# EasyEDA schematic SCH_TRAILDEV.json
TITLE: Sheet_1; REV: 1.0; Date: 2024-04-24; Sheet: 1/1; Drawn By: rivques; Company: Your Company
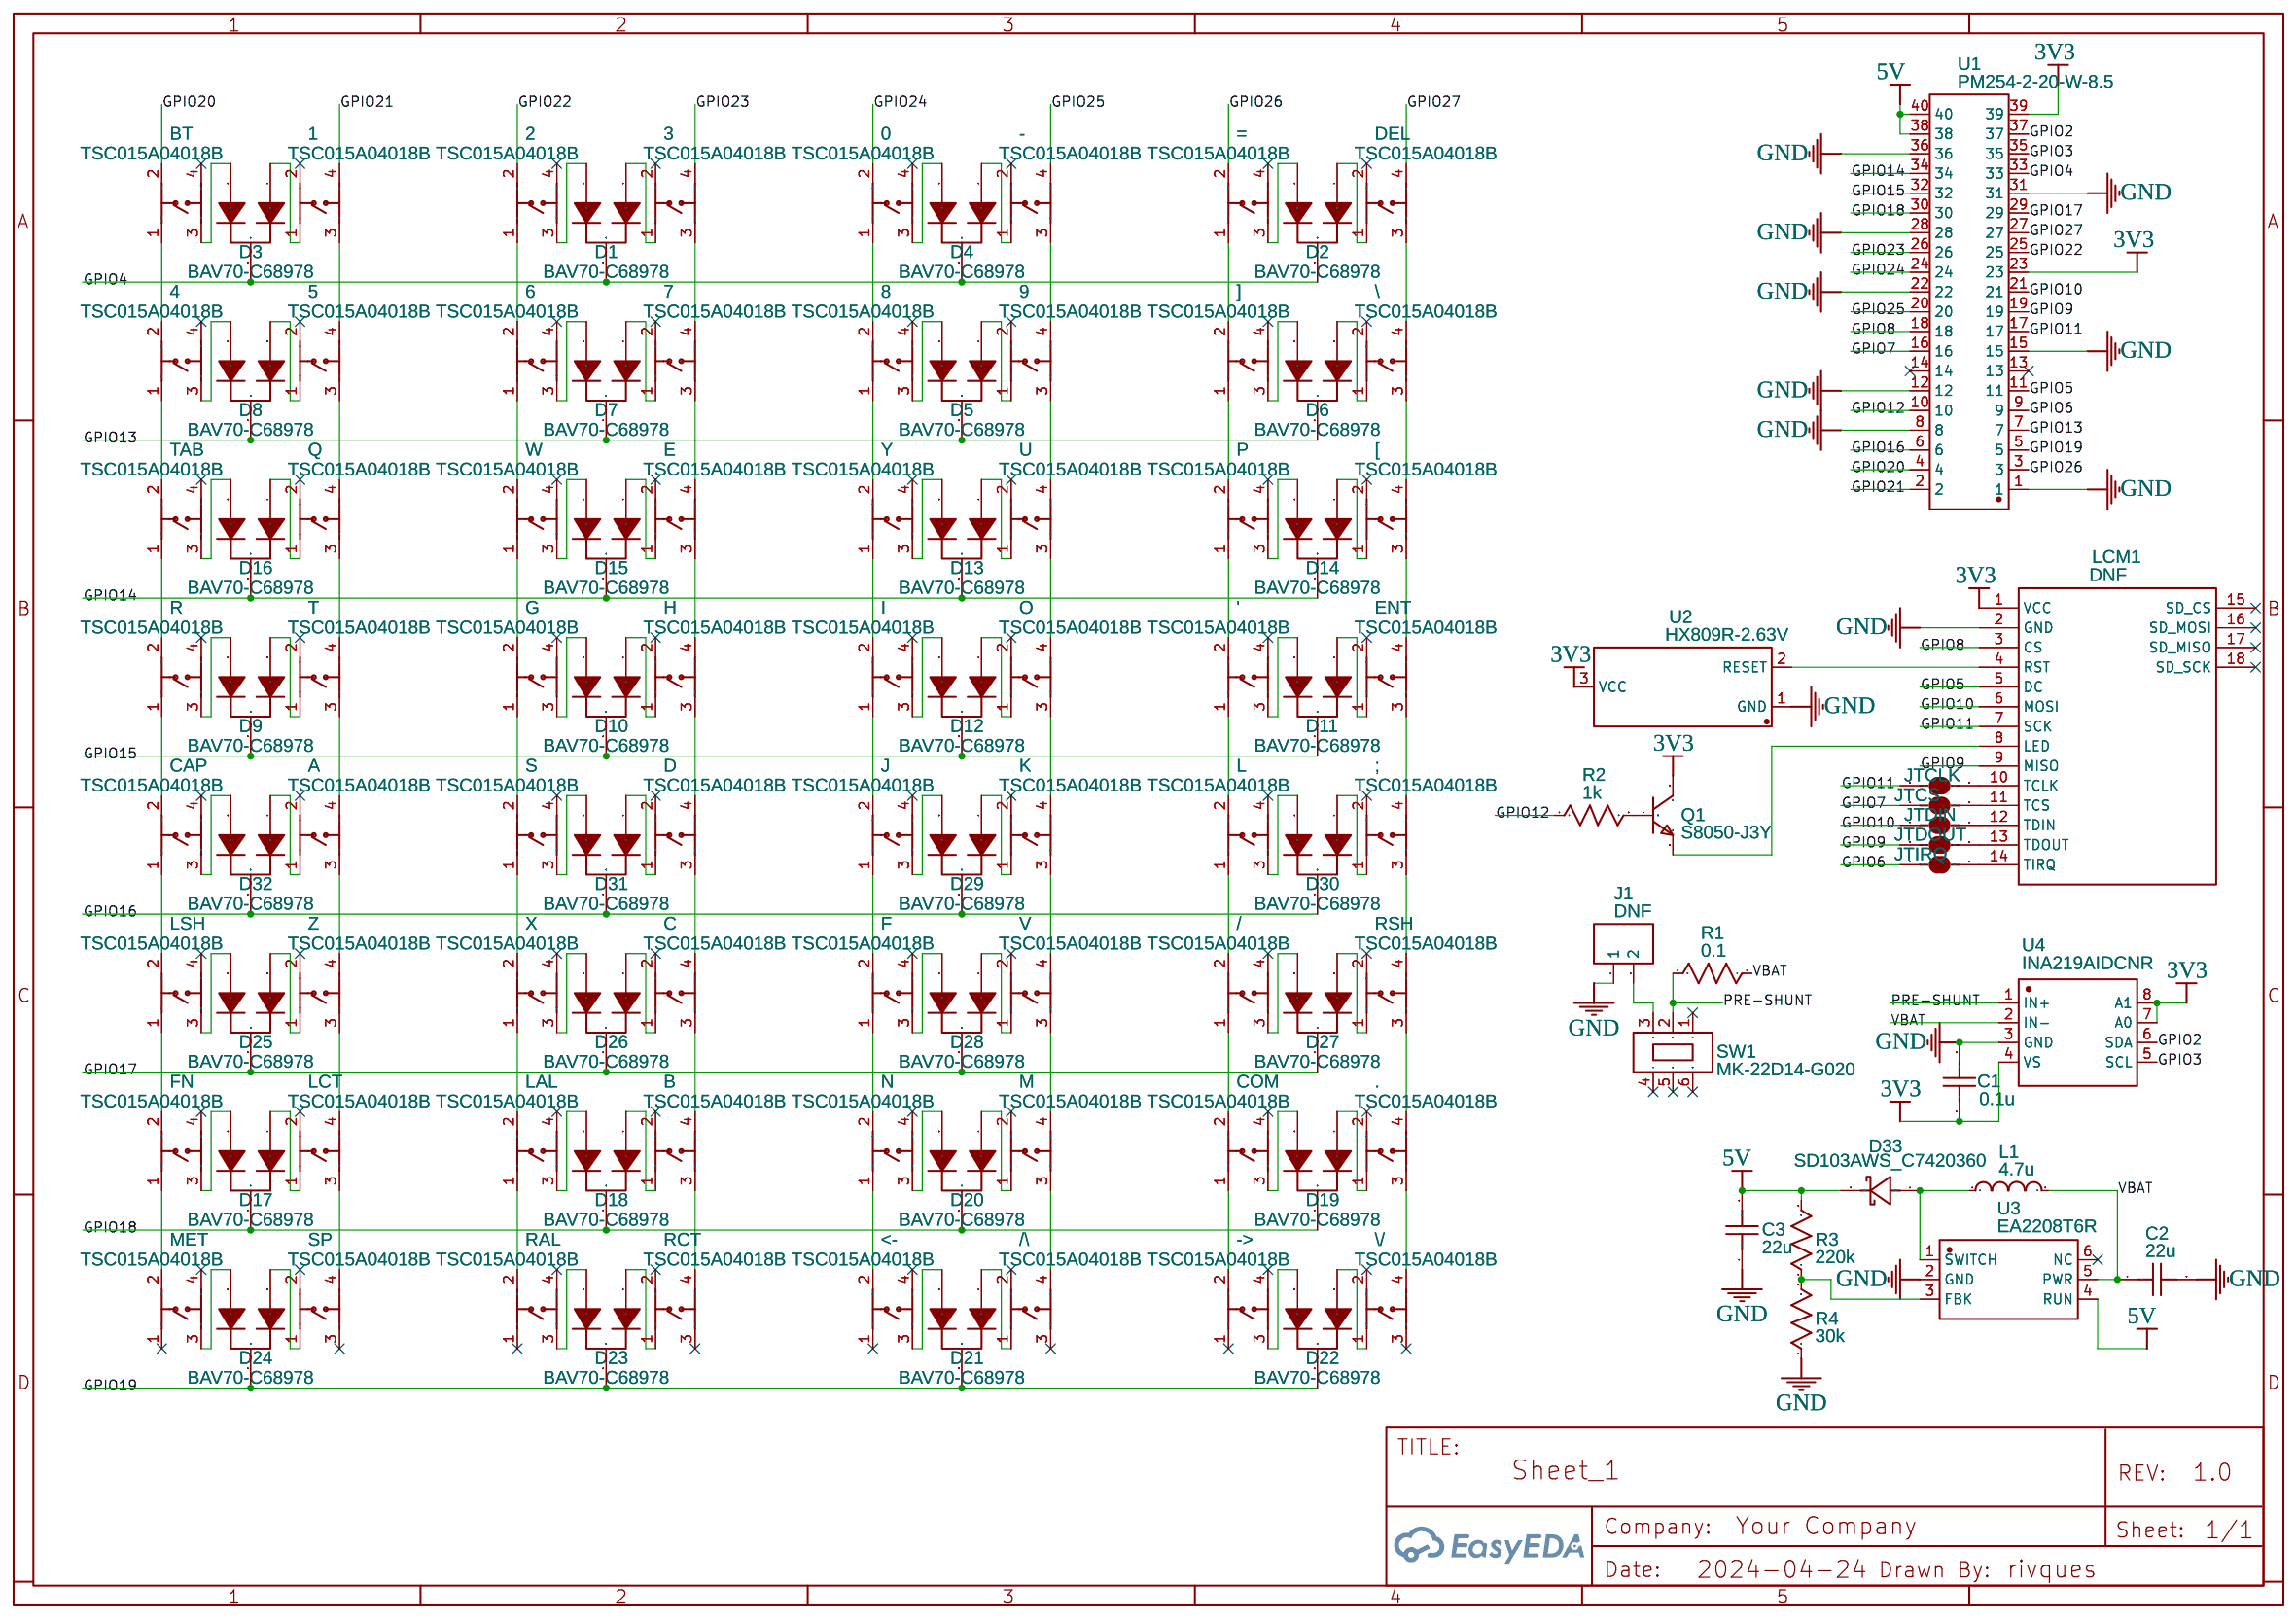
[diagram p0: schematic sheet]

## Parts
0  TSC015A04018B  [SW-SMD_4P-L4.5-W4.5-P3.00-LS6.8]
1  TSC015A04018B  [SW-SMD_4P-L4.5-W4.5-P3.00-LS6.8]
2  TSC015A04018B  [SW-SMD_4P-L4.5-W4.5-P3.00-LS6.8]
3  TSC015A04018B  [SW-SMD_4P-L4.5-W4.5-P3.00-LS6.8]
4  TSC015A04018B  [SW-SMD_4P-L4.5-W4.5-P3.00-LS6.8]
5  TSC015A04018B  [SW-SMD_4P-L4.5-W4.5-P3.00-LS6.8]
6  TSC015A04018B  [SW-SMD_4P-L4.5-W4.5-P3.00-LS6.8]
7  TSC015A04018B  [SW-SMD_4P-L4.5-W4.5-P3.00-LS6.8]
8  TSC015A04018B  [SW-SMD_4P-L4.5-W4.5-P3.00-LS6.8]
9  TSC015A04018B  [SW-SMD_4P-L4.5-W4.5-P3.00-LS6.8]
'  TSC015A04018B  [SW-SMD_4P-L4.5-W4.5-P3.00-LS6.8]
-  TSC015A04018B  [SW-SMD_4P-L4.5-W4.5-P3.00-LS6.8]
->  TSC015A04018B  [SW-SMD_4P-L4.5-W4.5-P3.00-LS6.8]
.  TSC015A04018B  [SW-SMD_4P-L4.5-W4.5-P3.00-LS6.8]
/  TSC015A04018B  [SW-SMD_4P-L4.5-W4.5-P3.00-LS6.8]
/\  TSC015A04018B  [SW-SMD_4P-L4.5-W4.5-P3.00-LS6.8]
;  TSC015A04018B  [SW-SMD_4P-L4.5-W4.5-P3.00-LS6.8]
<-  TSC015A04018B  [SW-SMD_4P-L4.5-W4.5-P3.00-LS6.8]
=  TSC015A04018B  [SW-SMD_4P-L4.5-W4.5-P3.00-LS6.8]
[  TSC015A04018B  [SW-SMD_4P-L4.5-W4.5-P3.00-LS6.8]
\  TSC015A04018B  [SW-SMD_4P-L4.5-W4.5-P3.00-LS6.8]
\/  TSC015A04018B  [SW-SMD_4P-L4.5-W4.5-P3.00-LS6.8]
]  TSC015A04018B  [SW-SMD_4P-L4.5-W4.5-P3.00-LS6.8]
A  TSC015A04018B  [SW-SMD_4P-L4.5-W4.5-P3.00-LS6.8]
B  TSC015A04018B  [SW-SMD_4P-L4.5-W4.5-P3.00-LS6.8]
BT  TSC015A04018B  [SW-SMD_4P-L4.5-W4.5-P3.00-LS6.8]
C  TSC015A04018B  [SW-SMD_4P-L4.5-W4.5-P3.00-LS6.8]
C1  0.1u  [C0402]
C2  22u  [C0402]
C3  22u  [C0402]
CAP  TSC015A04018B  [SW-SMD_4P-L4.5-W4.5-P3.00-LS6.8]
COM  TSC015A04018B  [SW-SMD_4P-L4.5-W4.5-P3.00-LS6.8]
D  TSC015A04018B  [SW-SMD_4P-L4.5-W4.5-P3.00-LS6.8]
D1  BAV70-C68978  [SOT-23-3_L3.0-W1.7-P0.95-LS2.9-BR]
D2  BAV70-C68978  [SOT-23-3_L3.0-W1.7-P0.95-LS2.9-BR]
D3  BAV70-C68978  [SOT-23-3_L3.0-W1.7-P0.95-LS2.9-BR]
D4  BAV70-C68978  [SOT-23-3_L3.0-W1.7-P0.95-LS2.9-BR]
D5  BAV70-C68978  [SOT-23-3_L3.0-W1.7-P0.95-LS2.9-BR]
D6  BAV70-C68978  [SOT-23-3_L3.0-W1.7-P0.95-LS2.9-BR]
D7  BAV70-C68978  [SOT-23-3_L3.0-W1.7-P0.95-LS2.9-BR]
D8  BAV70-C68978  [SOT-23-3_L3.0-W1.7-P0.95-LS2.9-BR]
D9  BAV70-C68978  [SOT-23-3_L3.0-W1.7-P0.95-LS2.9-BR]
D10  BAV70-C68978  [SOT-23-3_L3.0-W1.7-P0.95-LS2.9-BR]
D11  BAV70-C68978  [SOT-23-3_L3.0-W1.7-P0.95-LS2.9-BR]
D12  BAV70-C68978  [SOT-23-3_L3.0-W1.7-P0.95-LS2.9-BR]
D13  BAV70-C68978  [SOT-23-3_L3.0-W1.7-P0.95-LS2.9-BR]
D14  BAV70-C68978  [SOT-23-3_L3.0-W1.7-P0.95-LS2.9-BR]
D15  BAV70-C68978  [SOT-23-3_L3.0-W1.7-P0.95-LS2.9-BR]
D16  BAV70-C68978  [SOT-23-3_L3.0-W1.7-P0.95-LS2.9-BR]
D17  BAV70-C68978  [SOT-23-3_L3.0-W1.7-P0.95-LS2.9-BR]
D18  BAV70-C68978  [SOT-23-3_L3.0-W1.7-P0.95-LS2.9-BR]
D19  BAV70-C68978  [SOT-23-3_L3.0-W1.7-P0.95-LS2.9-BR]
D20  BAV70-C68978  [SOT-23-3_L3.0-W1.7-P0.95-LS2.9-BR]
D21  BAV70-C68978  [SOT-23-3_L3.0-W1.7-P0.95-LS2.9-BR]
D22  BAV70-C68978  [SOT-23-3_L3.0-W1.7-P0.95-LS2.9-BR]
D23  BAV70-C68978  [SOT-23-3_L3.0-W1.7-P0.95-LS2.9-BR]
D24  BAV70-C68978  [SOT-23-3_L3.0-W1.7-P0.95-LS2.9-BR]
D25  BAV70-C68978  [SOT-23-3_L3.0-W1.7-P0.95-LS2.9-BR]
D26  BAV70-C68978  [SOT-23-3_L3.0-W1.7-P0.95-LS2.9-BR]
D27  BAV70-C68978  [SOT-23-3_L3.0-W1.7-P0.95-LS2.9-BR]
D28  BAV70-C68978  [SOT-23-3_L3.0-W1.7-P0.95-LS2.9-BR]
D29  BAV70-C68978  [SOT-23-3_L3.0-W1.7-P0.95-LS2.9-BR]
D30  BAV70-C68978  [SOT-23-3_L3.0-W1.7-P0.95-LS2.9-BR]
D31  BAV70-C68978  [SOT-23-3_L3.0-W1.7-P0.95-LS2.9-BR]
D32  BAV70-C68978  [SOT-23-3_L3.0-W1.7-P0.95-LS2.9-BR]
D33  SD103AWS_C7420360  [SOD-323_L1.7-W1.3-LS2.5-FD]
DEL  TSC015A04018B  [SW-SMD_4P-L4.5-W4.5-P3.00-LS6.8]
E  TSC015A04018B  [SW-SMD_4P-L4.5-W4.5-P3.00-LS6.8]
ENT  TSC015A04018B  [SW-SMD_4P-L4.5-W4.5-P3.00-LS6.8]
F  TSC015A04018B  [SW-SMD_4P-L4.5-W4.5-P3.00-LS6.8]
FN  TSC015A04018B  [SW-SMD_4P-L4.5-W4.5-P3.00-LS6.8]
G  TSC015A04018B  [SW-SMD_4P-L4.5-W4.5-P3.00-LS6.8]
H  TSC015A04018B  [SW-SMD_4P-L4.5-W4.5-P3.00-LS6.8]
I  TSC015A04018B  [SW-SMD_4P-L4.5-W4.5-P3.00-LS6.8]
J  TSC015A04018B  [SW-SMD_4P-L4.5-W4.5-P3.00-LS6.8]
J1  DNF  [HDR-M-2.54_1X2]
JTCLK  J-TCLK  [SJ_2S-TRACE]
JTCS  JUMPER  [SJ_2S-TRACE]
JTDIN  JUMPER  [SJ_2S-TRACE]
JTDOUT  JUMPER  [SJ_2S-TRACE]
JTIRQ  JUMPER  [SJ_2S-TRACE]
K  TSC015A04018B  [SW-SMD_4P-L4.5-W4.5-P3.00-LS6.8]
L  TSC015A04018B  [SW-SMD_4P-L4.5-W4.5-P3.00-LS6.8]
L1  4.7u  [L0603]
LAL  TSC015A04018B  [SW-SMD_4P-L4.5-W4.5-P3.00-LS6.8]
LCM1  DNF  [2.8_TFT_TS_ASHOK]
LCT  TSC015A04018B  [SW-SMD_4P-L4.5-W4.5-P3.00-LS6.8]
LSH  TSC015A04018B  [SW-SMD_4P-L4.5-W4.5-P3.00-LS6.8]
M  TSC015A04018B  [SW-SMD_4P-L4.5-W4.5-P3.00-LS6.8]
MET  TSC015A04018B  [SW-SMD_4P-L4.5-W4.5-P3.00-LS6.8]
N  TSC015A04018B  [SW-SMD_4P-L4.5-W4.5-P3.00-LS6.8]
O  TSC015A04018B  [SW-SMD_4P-L4.5-W4.5-P3.00-LS6.8]
P  TSC015A04018B  [SW-SMD_4P-L4.5-W4.5-P3.00-LS6.8]
Q  TSC015A04018B  [SW-SMD_4P-L4.5-W4.5-P3.00-LS6.8]
Q1  S8050-J3Y  [SOT-23-3_L3.0-W1.7-P0.95-LS2.9-BR]
R  TSC015A04018B  [SW-SMD_4P-L4.5-W4.5-P3.00-LS6.8]
R1  0.1  [R2512]
R2  1k  [R0402]
R3  220k  [R0402]
R4  30k  [R0603]
RAL  TSC015A04018B  [SW-SMD_4P-L4.5-W4.5-P3.00-LS6.8]
RCT  TSC015A04018B  [SW-SMD_4P-L4.5-W4.5-P3.00-LS6.8]
RSH  TSC015A04018B  [SW-SMD_4P-L4.5-W4.5-P3.00-LS6.8]
S  TSC015A04018B  [SW-SMD_4P-L4.5-W4.5-P3.00-LS6.8]
SP  TSC015A04018B  [SW-SMD_4P-L4.5-W4.5-P3.00-LS6.8]
SW1  MK-22D14-G020  [SW-TH_MK-22D14-G020]
T  TSC015A04018B  [SW-SMD_4P-L4.5-W4.5-P3.00-LS6.8]
TAB  TSC015A04018B  [SW-SMD_4P-L4.5-W4.5-P3.00-LS6.8]
U  TSC015A04018B  [SW-SMD_4P-L4.5-W4.5-P3.00-LS6.8]
U1  PM254-2-20-W-8.5  [HDR-TH_40P-P2.54-H-F-R2-C20-W8.5]
U2  HX809R-2.63V  [SOT-23-3_L2.9-W1.3-P1.90-LS2.4-BR]
U3  EA2208T6R  [SOT-23-6_L2.9-W1.6-P0.95-LS2.8-BR]
U4  INA219AIDCNR  [SOT-23-8_L3.0-W1.7-P0.65-LS2.8-BR]
V  TSC015A04018B  [SW-SMD_4P-L4.5-W4.5-P3.00-LS6.8]
W  TSC015A04018B  [SW-SMD_4P-L4.5-W4.5-P3.00-LS6.8]
X  TSC015A04018B  [SW-SMD_4P-L4.5-W4.5-P3.00-LS6.8]
Y  TSC015A04018B  [SW-SMD_4P-L4.5-W4.5-P3.00-LS6.8]
Z  TSC015A04018B  [SW-SMD_4P-L4.5-W4.5-P3.00-LS6.8]

## Library data of the parts
0-9 ' - -> . / /\ ; <- = [ \ \/ ] A B BT C CAP COM D DEL E ENT F FN G H I J K L LAL LCT LSH M MET N O P Q R RAL RCT RSH S SP T TAB U V W X Y Z = TSC015A04018B: Contributor: LCSC; Supplier: LCSC; Supplier Part: C2888504; Manufacturer: BZCN(博众电气); JLCPCB Part Class: Extended Part
C1-C3 = C_0402_US: Contributor: LCEDA_Lib
D1-D32 = BAV70-C68978: Supplier: LCSC; Manufacturer: CJ(江苏长电/长晶); Manufacturer Part: BAV70; Supplier Part: C68978; JLCPCB Part Class: Basic Part
D33 = SD103AWS_C7420360: Supplier: LCSC; Supplier Part: C7420360; Manufacturer: 宏迦橙; Manufacturer Part: SD103AWS; JLCPCB Part Class: Extended Part; Contributor: lcsc
J1 = HDR-M-2.54_1x2: Supplier Part: C124375; Supplier: LCSC; Contributor: LCEDA_Lib
JTCLK JTCS JTDIN JTDOUT JTIRQ = SOLDERJUMPERTRACE: Solder Jumper; Contributor: SparkFun
L1 = L0603_US: Contributor: LCEDA_Lib
LCM1 = TFTSPI-2.8-240x320: Contributor: jackyw1368; Package Display: No
Q1 = S8050-J3Y: Contributor: LCSC; Supplier: LCSC; Supplier Part: C364312; Manufacturer: MDD; JLCPCB Part Class: Extended Part
R1 = R_2512_US: Supplier Part: C2985674; Supplier: LCSC; Contributor: LCEDA_Lib
R2 = R_0402_US: Contributor: LCEDA_Lib
R3 R4 = R_0603_US: Contributor: LCEDA_Lib
SW1 = MK-22D14-G020: Contributor: LCSC; Supplier: LCSC; Supplier Part: C963207; Manufacturer: G-Switch(品赞); JLCPCB Part Class: Extended Part
U1 = PM254-2-20-W-8.5: Contributor: LCSC; Supplier: LCSC; Supplier Part: C2897440; Manufacturer: HCTL(华灿天禄); JLCPCB Part Class: Extended Part
U2 = HX809R-2.63V: Contributor: LCSC; Supplier: LCSC; Supplier Part: C296138; Manufacturer: HX(恒佳兴); JLCPCB Part Class: Extended Part
U3 = EA2208T6R: Contributor: LCSC; Supplier: LCSC; Supplier Part: C2961138; Manufacturer: everanalog(申风); JLCPCB Part Class: Extended Part
U4 = INA219AIDCNR: Contributor: LCSC; Supplier: LCSC; Manufacturer: TI(德州仪器); Supplier Part: C87469; JLCPCB Part Class: Extended Part

## Nets
3V3: C1.1 LCM1.1(VCC) Q1.3(C) U1.23 U1.39 U2.3(VCC) U4.4(VS) U4.7(A0) U4.8(A1)
5V: C3.2 D33.2(K) R3.2 U1.38 U1.40 U3.4(RUN)
GND: C1.2 C2.2 C3.1 J1.1 LCM1.2(GND) R4.1 U1.1 U1.8 U1.12 U1.15 U1.22 U1.28 U1.31 U1.36 U2.1(GND) U3.2(GND) U4.3(GND)
VBAT: C2.1 L1.2 R1.1 U3.5(PWR) U4.2(IN-)
GPIO2: U1.37 U4.6(SDA)
GPIO3: U1.35 U4.5(SCL)
GPIO4: D1.3 D2.3 D3.3 D4.3 U1.33
GPIO5: LCM1.5(DC) U1.11
GPIO6: JTIRQ.1 U1.9
GPIO7: JTCS.1 U1.16
GPIO8: LCM1.3(CS) U1.18
GPIO9: JTDOUT.1 LCM1.9(MISO) U1.19
GPIO10: JTDIN.1 LCM1.6(MOSI) U1.21
GPIO11: JTCLK.1 LCM1.7(SCK) U1.17
GPIO12: R2.1 U1.10
GPIO13: D5.3 D6.3 D7.3 D8.3 U1.7
GPIO14: D13.3 D14.3 D15.3 D16.3 U1.34
GPIO15: D9.3 D10.3 D11.3 D12.3 U1.32
GPIO16: D29.3 D30.3 D31.3 D32.3 U1.6
GPIO17: D25.3 D26.3 D27.3 D28.3 U1.29
GPIO18: D17.3 D18.3 D19.3 D20.3 U1.30
GPIO19: D21.3 D22.3 D23.3 D24.3 U1.5
GPIO20: BT.2 U1.4
GPIO21: 1.4 U1.2
GPIO22: 2.2 U1.25
GPIO23: 3.4 U1.26
GPIO24: 0.2 U1.24
GPIO25: -.4 U1.20
GPIO26: =.2 U1.3
GPIO27: DEL.4 U1.27
PRE-SHUNT: R1.2 SW1.2 U4.1(IN+)
Net-(0-1): 0.1 8.2
Net-(0-3): 0.3 D4.2
Net-(1-1): 1.1 D3.1
Net-(1-3): 1.3 5.4
Net-(2-1): 2.1 6.2
Net-(2-3): 2.3 D1.2
Net-(3-1): 3.1 D1.1
Net-(3-3): 3.3 7.4
Net-(4-1): 4.1 TAB.2
Net-(4-2): 4.2 BT.1
Net-(4-3): 4.3 D8.2
Net-(5-1): 5.1 D8.1
Net-(5-3): 5.3 Q.4
Net-(6-1): 6.1 W.2
Net-(6-3): 6.3 D7.2
Net-(7-1): 7.1 D7.1
Net-(7-3): 7.3 E.4
Net-(8-1): 8.1 Y.2
Net-(8-3): 8.3 D5.2
Net-(9-1): 9.1 D5.1
Net-(9-3): 9.3 U.4
Net-(9-4): 9.4 -.3
Net-('-1): '.1 L.2
Net-('-2): '.2 P.1
Net-('-3): '.3 D11.2
Net-(--1): -.1 D4.1
Net-(->-2): ->.2 COM.1
Net-(->-3): ->.3 D22.2
Net-(.-1): ..1 D19.1
Net-(.-3): ..3 \/.4
Net-(.-4): ..4 RSH.3
Net-(/-1): /.1 COM.2
Net-(/-2): /.2 L.1
Net-(/-3): /.3 D27.2
Net-(/\-1): /\.1 D21.1
Net-(/\-4): /\.4 M.3
Net-(;-1): ;.1 D30.1
Net-(;-3): ;.3 RSH.4
Net-(;-4): ;.4 ENT.3
Net-(<--2): <-.2 N.1
Net-(<--3): <-.3 D21.2
Net-(=-1): =.1 ].2
Net-(=-3): =.3 D2.2
Net-([-1): [.1 D14.1
Net-([-3): [.3 ENT.4
Net-([-4): [.4 \.3
Net-(\-1): \.1 D6.1
Net-(\-4): \.4 DEL.3
Net-(\/-1): \/.1 D22.1
Net-(]-1): ].1 P.2
Net-(]-3): ].3 D6.2
Net-(A-1): A.1 D32.1
Net-(A-3): A.3 Z.4
Net-(A-4): A.4 T.3
Net-(B-1): B.1 D18.1
Net-(B-3): B.3 RCT.4
Net-(B-4): B.4 C.3
Net-(BT-3): BT.3 D3.2
Net-(C-1): C.1 D26.1
Net-(C-4): C.4 D.3
Net-(CAP-1): CAP.1 LSH.2
Net-(CAP-2): CAP.2 R.1
Net-(CAP-3): CAP.3 D32.2
Net-(COM-3): COM.3 D19.2
Net-(D2-1): D2.1 DEL.1
Net-(D9-1): D9.1 T.1
Net-(D9-2): D9.2 R.3
Net-(D10-1): D10.1 H.1
Net-(D10-2): D10.2 G.3
Net-(D11-1): D11.1 ENT.1
Net-(D12-1): D12.1 O.1
Net-(D12-2): D12.2 I.3
Net-(D13-1): D13.1 U.1
Net-(D13-2): D13.2 Y.3
Net-(D14-2): D14.2 P.3
Net-(D15-1): D15.1 E.1
Net-(D15-2): D15.2 W.3
Net-(D16-1): D16.1 Q.1
Net-(D16-2): D16.2 TAB.3
Net-(D17-1): D17.1 LCT.1
Net-(D17-2): D17.2 FN.3
Net-(D18-2): D18.2 LAL.3
Net-(D20-1): D20.1 M.1
Net-(D20-2): D20.2 N.3
Net-(D23-1): D23.1 RCT.1
Net-(D23-2): D23.2 RAL.3
Net-(D24-1): D24.1 SP.1
Net-(D24-2): D24.2 MET.3
Net-(D25-1): D25.1 Z.1
Net-(D25-2): D25.2 LSH.3
Net-(D26-2): D26.2 X.3
Net-(D27-1): D27.1 RSH.1
Net-(D28-1): D28.1 V.1
Net-(D28-2): D28.2 F.3
Net-(D29-1): D29.1 K.1
Net-(D29-2): D29.2 J.3
Net-(D30-2): D30.2 L.3
Net-(D31-2): D31.2 S.3
Net-(D33-1): D33.1(A) L1.1 U3.1(SWITCH)
Net-(D-1): D.1 D31.1
Net-(D-4): D.4 H.3
Net-(E-3): E.3 H.4
Net-(F-1): F.1 N.2
Net-(F-2): F.2 J.1
Net-(FN-1): FN.1 MET.2
Net-(FN-2): FN.2 LSH.1
Net-(G-1): G.1 S.2
Net-(G-2): G.2 W.1
Net-(I-1): I.1 J.2
Net-(I-2): I.2 Y.1
Net-(J1-2): J1.2 SW1.3
Net-(JTCLK-2): JTCLK.2 LCM1.10(TCLK)
Net-(JTCS-2): JTCS.2 LCM1.11(TCS)
Net-(JTDIN-2): JTDIN.2 LCM1.12(TDIN)
Net-(JTDOUT-2): JTDOUT.2 LCM1.13(TDOUT)
Net-(JTIRQ-2): JTIRQ.2 LCM1.14(TIRQ)
Net-(K-3): K.3 V.4
Net-(K-4): K.4 O.3
Net-(LAL-1): LAL.1 RAL.2
Net-(LAL-2): LAL.2 X.1
Net-(LCM1-4): LCM1.4(RST) U2.2(RESET)
Net-(LCM1-8): LCM1.8(LED) Q1.2(E)
Net-(LCT-3): LCT.3 SP.4
Net-(LCT-4): LCT.4 Z.3
Net-(M-4): M.4 V.3
Net-(O-4): O.4 U.3
Net-(Q1-1): Q1.1(B) R2.2
Net-(Q-3): Q.3 T.4
Net-(R3-1): R3.1 R4.2 U3.3(FBK)
Net-(R-2): R.2 TAB.1
Net-(S-1): S.1 X.2

Not connected (* = marked no-connect by the designer): 0 4*; 1 2*; 2 4*; 3 2*; 4 4*; 5 2*; 6 4*; 7 2*; 8 4*; 9 2*; ' 4*; - 2*; -> 1* 4*; . 2*; / 4*; /\ 2* 3*; ; 2*; <- 1* 4*; = 4*; [ 2*; \ 2*; \/ 2* 3*; ] 4*; A 2*; B 2*; BT 4*; C 2*; CAP 4*; COM 4*; D 2*; DEL 2*; E 2*; ENT 2*; F 4*; FN 4*; G 4*; H 2*; I 4*; J 4*; K 2*; L 4*; LAL 4*; LCM1 15(SD_CS)* 16(SD_MOSI)* 17(SD_MISO)* 18(SD_SCK)*; LCT 2*; LSH 4*; M 2*; MET 1* 4*; N 4*; O 2*; P 4*; Q 2*; R 4*; RAL 1* 4*; RCT 2* 3*; RSH 2*; S 4*; SP 2* 3*; SW1 1* 4* 5* 6*; T 2*; TAB 4*; U 2*; U1 13* 14*; U3 6(NC)*; V 2*; W 4*; X 4*; Y 4*; Z 2*
